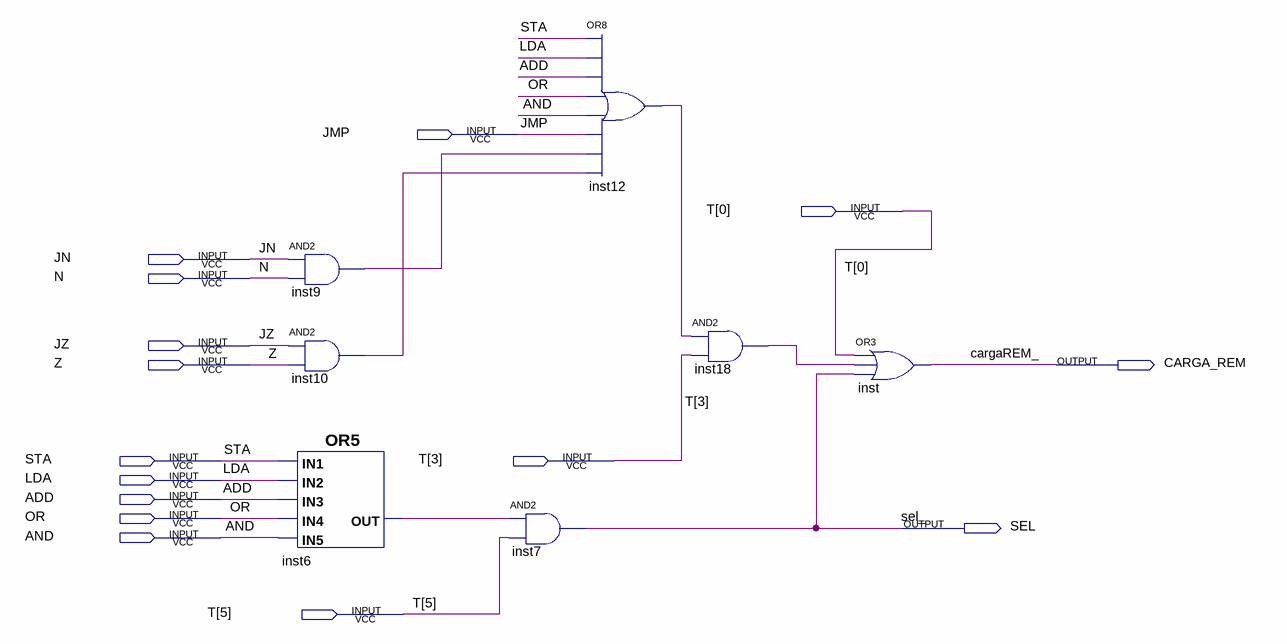
[diagram p0: schematic sheet]
// Quartus schematic UNIDADE_CONTROLE_CARGAS_REM_SEL.bdf as structural Verilog: 7 symbols, 15 pins
module UNIDADE_CONTROLE_CARGAS_REM_SEL (
  input  JMP,
  input  [5:0] T,
  input  JN,
  input  N,
  input  JZ,
  input  Z,
  input  STA,
  input  LDA,
  input  ADD,
  input  OR,
  input  AND,
  output CARGA_REM,
  output SEL
);

  wire inst6_out, inst9_out, inst10_out, inst12_out, inst18_out;

  and inst9 (inst9_out, JN, N);
  and inst10 (inst10_out, JZ, Z);
  or inst6 (inst6_out, STA, LDA, ADD, OR, AND);
  and inst7 (SEL, inst6_out, T[5]);
  or inst12 (inst12_out, STA, LDA, ADD, OR, AND, JMP, inst9_out, inst10_out);
  and inst18 (inst18_out, inst12_out, T[3]);
  or inst (CARGA_REM, T[0], inst18_out, SEL);

  // Other names for the same wires on the sheet: cargaREM_ = CARGA_REM; sel_ = SEL
endmodule
